# EAGLE design pm-001 (EAGLE 9.1.0)
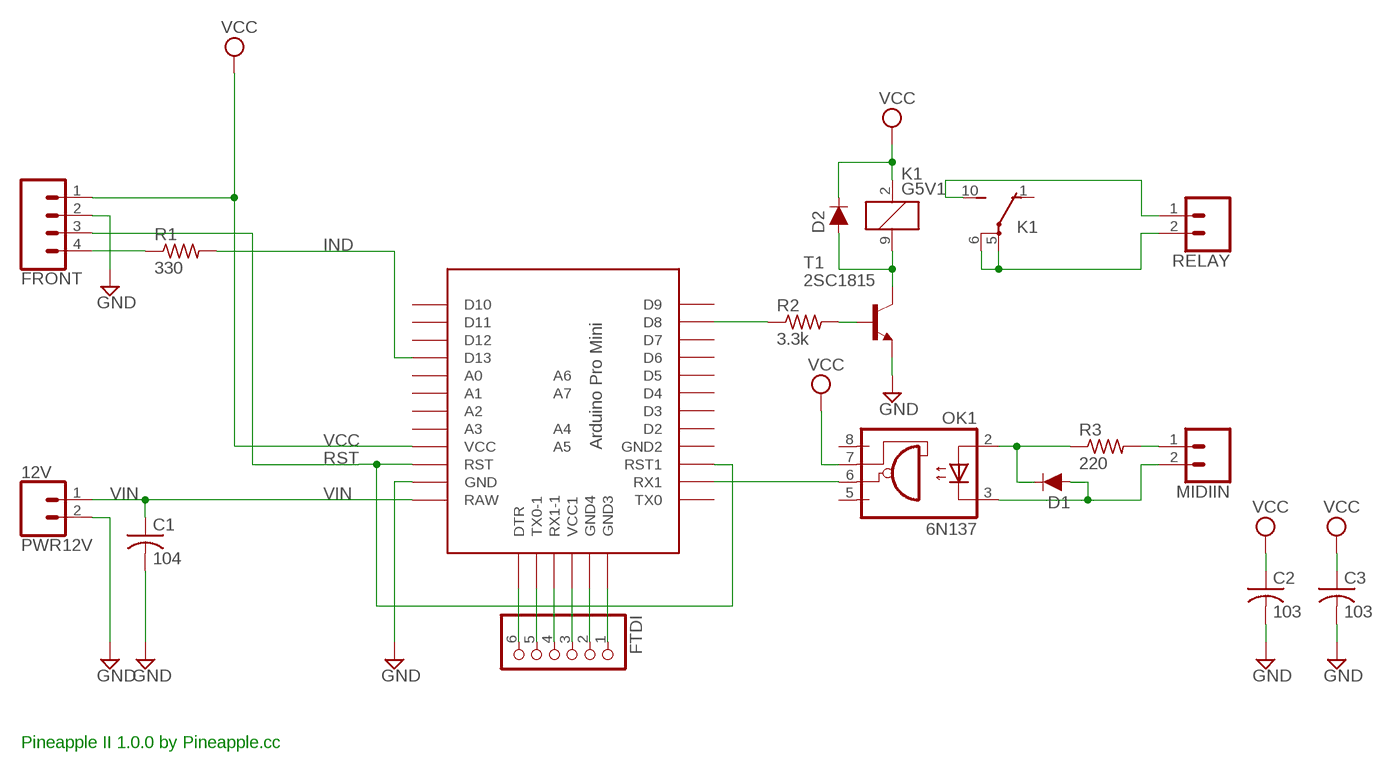
[diagram p0: schematic, sheet 1]

## Parts
C1  104  C-US025-025X050  [C025-025X050]
C2  103  C-US025-025X050  [C025-025X050]
C3  103  C-US025-025X050  [C025-025X050]
D1  DIODE-1N4148  [DIODE-1N4148]
D2  DIODE-1N4148  [DIODE-1N4148]
FRONT  CONN_04JST-PTH  [JST-4-PTH]
FTDI  PINHD-1X6  [1X06]
K1  G5V1  [G5V1]
MIDIIN  CONN_02JST-PTH-2  [JST-2-PTH]
OK1  6N137  [DIL08]
PWR12V  12V  CONN_02JST-PTH-2  [JST-2-PTH]
R1  330  R-US_0204/5  [0204/5]
R2  3.3k  R-US_0204/5  [0204/5]
R3  220  R-US_0204/5  [0204/5]
RELAY  CONN_02JST-PTH-2  [JST-2-PTH]
T1  2SC1815  [TO92-ECB]
U$1  PRO-MINI-2  [PRO-MINI-2]

## Nets
GND: C1.2 C2.2 C3.2 FRONT.2 PWR12V.2 T1.E U$1.GND
IND: R1.2 U$1.D13
N$1: FRONT.4 R1.1
N$2: MIDIIN.1 R3.2
N$3: OK1.6(VO) U$1.RX1
N$4: D1.C OK1.2(A) R3.1
N$5: D1.A MIDIIN.2 OK1.3(C)
N$6: R2.2 T1.B
N$7: R2.1 U$1.D8
N$8: D2.A K1.9 T1.C
N$9: FTDI.1 U$1.GND2(GND3)
N$10: K1.5(2:P) K1.6(2:P) RELAY.2
N$11: K1.10(2:S) RELAY.1
N$12: FTDI.2 U$1.GND3(GND4)
N$13: FTDI.3 U$1.VCC1
N$14: FTDI.4 U$1.RX1-1
N$15: FTDI.5 U$1.TX0-1
N$16: FTDI.6 U$1.DTR
RST: FRONT.3 U$1.RST U$1.RST1
VCC: C2.1 C3.1 D2.C FRONT.1 K1.2 OK1.7(VE) U$1.VCC
VIN: C1.1 PWR12V.1 U$1.RAW
Unconnected: K1.1(2:O) OK1.5(GND) OK1.8(VCC) U$1.A0 U$1.A1 U$1.A2 U$1.A3 U$1.A4 U$1.A5 U$1.A6 U$1.A7 U$1.D2 U$1.D3 U$1.D4 U$1.D5 U$1.D6 U$1.D7 U$1.D9 U$1.D10 U$1.D11 U$1.D12 U$1.GND1(GND2) U$1.TX0

## Notes on the sheet
- Pineapple II 1.0.0 by Pineapple.cc

## Library data of the parts
C1-C3 = rcl:C-US: CAPACITOR, American symbol
D1 D2 = SparkFun-DiscreteSemi:DIODE: Diode These are standard reverse protection diodes and small signal diodes. SparkFun Products: SparkFun SparkPunk Sound Kit <https://www.sparkfun.com/products/11177> SparkFun ESP8266 Thing <https://www.sparkfun.com/products/13231>; PROD_ID: DIO-08378; VALUE: 200mA/100V/1V
FRONT = SparkFun-Connectors:CONN_04: Multi connection point. Often used as Generic Header-pin footprint for 0.1 inch spaced/style header connections On any of the 0.1 inch spaced packages, you can populate with these: Break Away Headers - Straight <https://www.sparkfun.com/products/116> (PRT-00116) Break Away Male Headers - Right Angle <https://www.sparkfun.com/products/553> (PRT-00553) Female Headers <https://www.sparkfun.com/products/115> (PRT-00115) Break Away Headers - Machine Pin <https://www.sparkfun.com/products/117> (PRT-00117) Break Away Female Headers - Swiss Machine Pin <https://www.sparkfun.com/products/743> (PRT-00743) For SCREWTERMINALS and SPRING TERMINALS visit here: Screw Terimnals on SparkFun.com <https://www.sparkfun.com/search/results?term=Screw+Terminals> (5mm/3.5mm/2.54mm spacing) This device is also useful as a general connection point to wire up your design to another part of your project. Our various solder wires solder well into these plated through hole pads. Hook-Up Wire - Assortment (Stranded, 22 AWG) <https://www.sparkfun.com/products/11375> (PRT-11375) Hook-Up Wire - Assortment (Solid Core, 22 AWG) <https://www.sparkfun.com/products/11367> (PRT-11367) View the entire wire category on our website here <https://www.sparkfun.com/categories/141> Special notes: Molex polarized connector foot print use with SKU : PRT-08231 with associated crimp pins and housings. 1MM SMD Version SKU: PRT-10208; PROD_ID: WIRE-13531; SF_ID: PRT-09916
FTDI = pinhead:PINHD-1X6: PIN HEADER
K1 = relay:G5V1: RELAY 1 x switch, 0.5 A/125 V AC, 1 A/24 V DC , Omron; MPN: G5V-1-DC24; OC_FARNELL: 9949593; OC_NEWARK: 36M6377
MIDIIN PWR12V RELAY = SparkFun-Connectors:CONN_02: Multi connection point. Often used as Generic Header-pin footprint for 0.1 inch spaced/style header connections On any of the 0.1 inch spaced packages, you can populate with these: Break Away Headers - Straight <https://www.sparkfun.com/products/116> (PRT-00116) Break Away Male Headers - Right Angle <https://www.sparkfun.com/products/553> (PRT-00553) Female Headers <https://www.sparkfun.com/products/115> (PRT-00115) Break Away Headers - Machine Pin <https://www.sparkfun.com/products/117> (PRT-00117) Break Away Female Headers - Swiss Machine Pin <https://www.sparkfun.com/products/743> (PRT-00743) For SCREWTERMINALS and SPRING TERMINALS visit here: Screw Terimnals on SparkFun.com <https://www.sparkfun.com/search/results?term=Screw+Terminals> (5mm/3.5mm/2.54mm spacing) This device is also useful as a general connection point to wire up your design to another part of your project. Our various solder wires solder well into these plated through hole pads. Hook-Up Wire - Assortment (Stranded, 22 AWG) <https://www.sparkfun.com/products/11375> (PRT-11375) Hook-Up Wire - Assortment (Solid Core, 22 AWG) <https://www.sparkfun.com/products/11367> (PRT-11367) View the entire wire category on our website here <https://www.sparkfun.com/categories/141> Special notes: Molex polarized connector foot print use with: PRT-08233 with associated crimp pins and housings. 2.54_SCREWTERM for use with PRT-10571. 3.5mm Screw Terminal footprints for PRT-08084 5mm Screw Terminal footprints for use with PRT-08432; PROD_ID: CONN-09863; SKU: PRT-09914
OK1 = optocoupler:6N137: MOTOROLA OPTO COUPLER; MPN: 6N137; OC_FARNELL: 1328376; OC_NEWARK: 52M1895
R1-R3 = rcl:R-US_: RESISTOR, American symbol; SPICEPREFIX: R
T1 = transistor:2SC1815: NPN EPITAXIAL TRANSISTOR Source: TOSHIBA .. 2SC1815 1.pdf
U$1 = Arduino-clone:PRO-MINI-2: Arduino Pro Mini Layout 2 Sparkfun.com

## Net classes
0 default: width 0.254 mm, drill 0.254 mm, clearance 0.254 mm

## Board
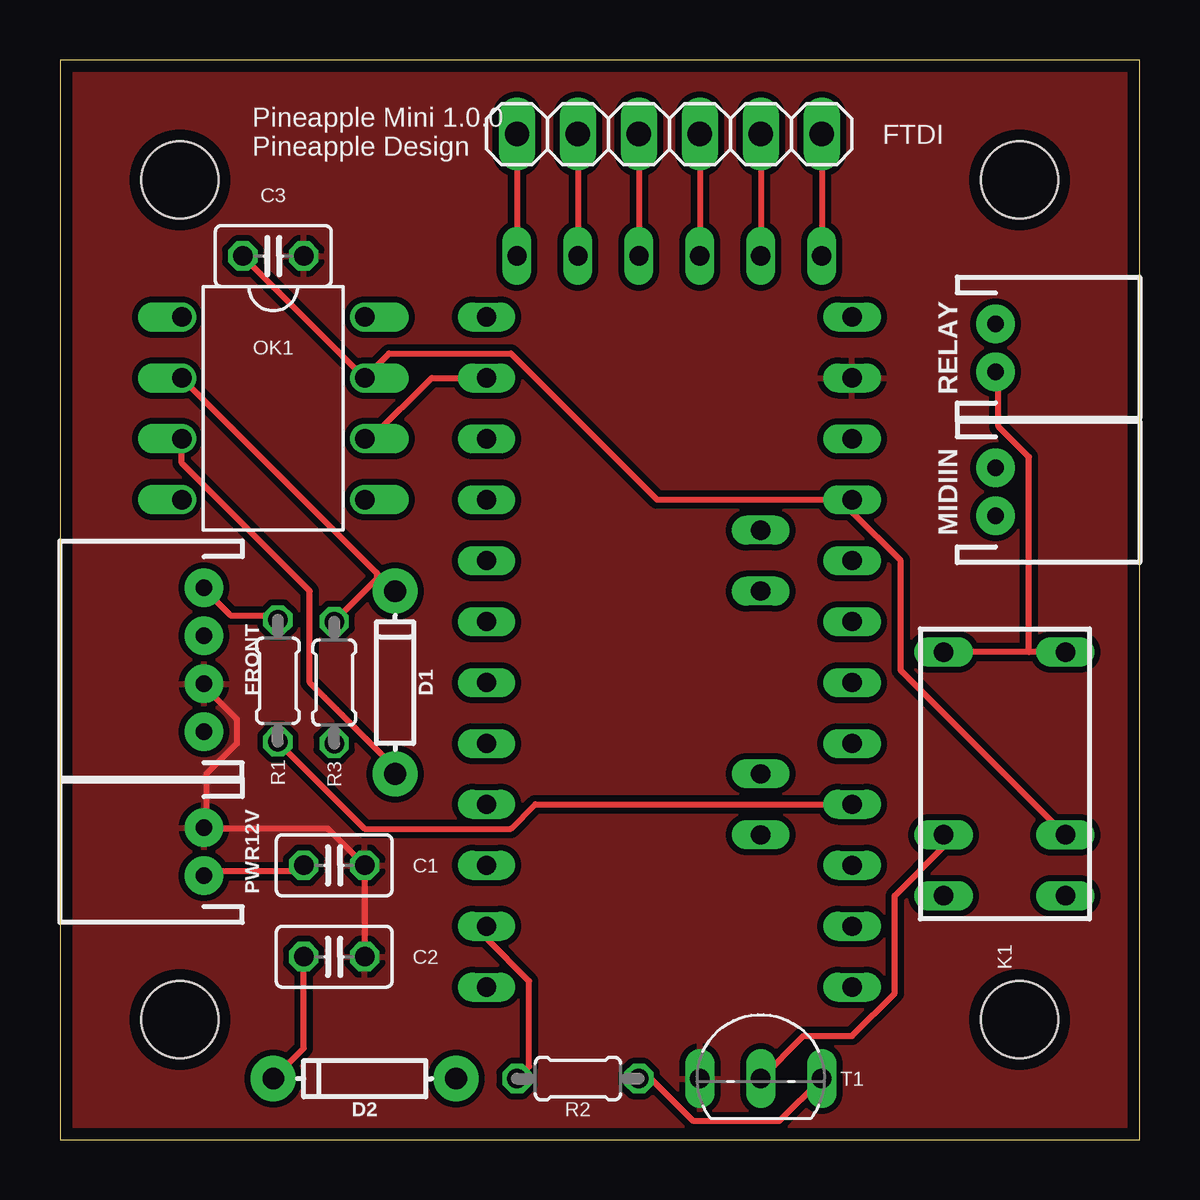
[diagram p1: board, top side]
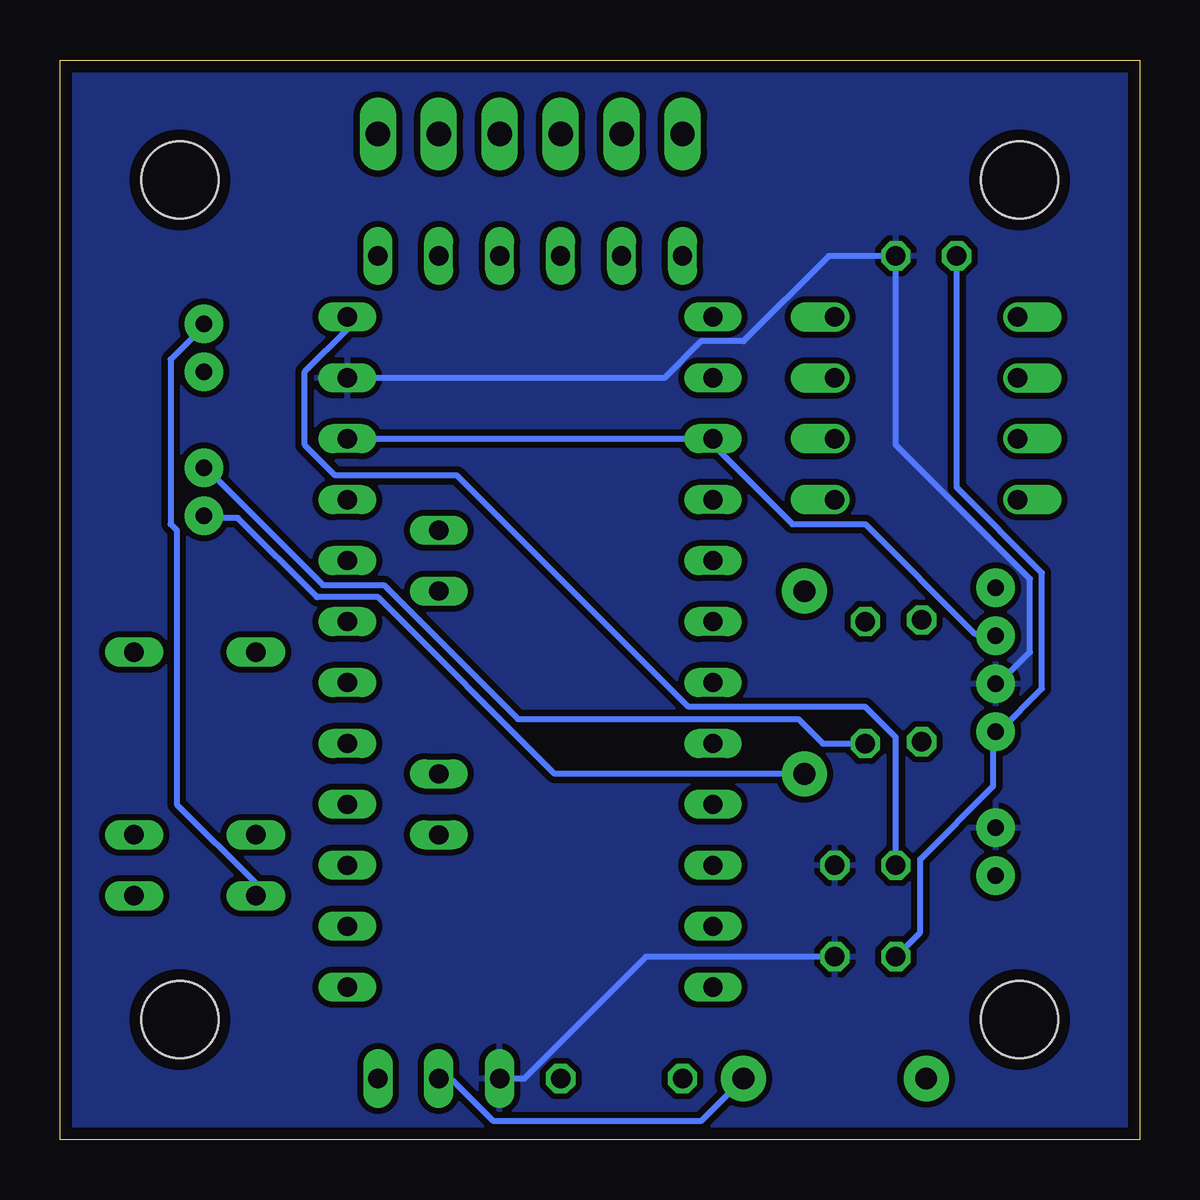
[diagram p2: board, bottom side, seen from below]

Size 45 x 45 mm. Coordinates in mm from the lower left corner, seen from the top.
Outline: 0,0 45,0 45,45 0,45 0,0
Copper layers (1*16): Top 0.035mm / dielectric 1.53mm / Bottom 0.035mm
Design rules "pban_5mil-l2": minimum track width 5mil, minimum drill 0.3mm, track to track 5mil, track to pad 0.229mm, pad to pad 5mil, via to via 5mil, smd to smd 5mil, copper to edge 0.5mm, drill to drill 0.5mm, minimum pad ring 0.15mm, minimum via ring 0.15mm, stop-mask expansion 4mil, vias tented up to drill 0.35mm, thermal gap 10mil
Holes 3.2 mm at 5,5 40,5 40,40 5,40

### Footprints (pad centres in the part's own frame; a part is rotated, then mirrored left to right if it is on the bottom)
C025-025X050 = drill 0.813 octagon: 1 -1.27,0; 2 1.27,0
DIODE-1N4148 = drill 0.9 pad 1.88: A -3.81,0; C 3.81,0
JST-4-PTH = drill 0.7 pad 1.6: 1 -3,0; 2 -1,0; 3 1,0; 4 3,0
1X06 = drill 1.016 long: 1 -6.35,0; 2 -3.81,0; 3 -1.27,0; 4 1.27,0; 5 3.81,0; 6 6.35,0
G5V1 = drill 0.813 long: 1 -5.08,-2.54; 2 -2.54,-2.54; 5 5.08,-2.54; 6 5.08,2.54; 9 -2.54,2.54; 10 -5.08,2.54
JST-2-PTH = drill 0.7 pad 1.6: 1 -1,0; 2 1,0
DIL08 = drill 0.813 offset: 1 -3.81,-3.81; 2 -1.27,-3.81; 3 1.27,-3.81; 4 3.81,-3.81; 5 3.81,3.81; 6 1.27,3.81; 7 -1.27,3.81; 8 -3.81,3.81
0204/5 = drill 0.813 octagon: 1 -2.54,0; 2 2.54,0
TO92-ECB = drill 0.813 long: B 2.54,0; C 0,0; E -2.54,0
PRO-MINI-2 = drill 0.8 long: A0 6.35,2.54; A1 6.35,0; A2 6.35,-2.54; A3 6.35,-5.08; A4 2.54,1.27; A5 2.54,3.81; A6 2.54,-8.89; A7 2.54,-6.35; D2 -8.89,2.54; D3 -8.89,0; D4 -8.89,-2.54; D5 -8.89,-5.08; D6 -8.89,-7.62; D7 -8.89,-10.16; D8 -8.89,-12.7; D9 -8.89,-15.24; D10 6.35,-15.24; D11 6.35,-12.7; D12 6.35,-10.16; D13 6.35,-7.62; DTR 5.08,15.24; GND 6.35,10.16; GND1 -8.89,5.08; GND2 -7.62,15.24; GND3 -5.08,15.24; RAW 6.35,12.7; RST 6.35,7.62; RST1 -8.89,7.62; RX1 -8.89,10.16; RX1-1 0,15.24; TX0 -8.89,12.7; TX0-1 2.54,15.24; VCC 6.35,5.08; VCC1 -2.54,15.24

### Placement (x,y rotation side)
C1  11.43,11.43 0 top
C2  11.43,7.62 0 top
C3  8.89,36.83 0 top
D1  13.97,19.05 90 top
D2  12.7,2.54 180 top
FRONT  6,20 90 top
FTDI  25.4,41.91 0 top
K1  39.37,15.24 90 top
MIDIIN  39,27 270 top
OK1  8.89,30.48 270 top
PWR12V  6,12 90 top
R1  9.08,19.12 270 top
R2  21.59,2.54 0 top
R3  11.43,19.05 270 top
RELAY  39,33 270 top
T1  29.21,2.54 0 top
U$1  26.67,21.59 0 top

### Tracks (layer width: path | path; a pad name or v marks a point on that pad's centre or on a via)
GND
  Top 0.254: FRONT.2 6.1,18.8 7.37,17.53 7.37,16.51 6.1,15.24 6.1,13.21 PWR12V.2 6.1,12.95 11.18,12.95 C1.2 C2.2
  Bottom 0.254: U$1.GND 19.81,31.75 18.29,33.27 16.51,33.27 12.95,36.83 C3.2 10.16,28.96 4.57,23.37 4.57,20.32 5.84,19.05 FRONT.2 | T1.E 25.65,2.54 20.57,7.62 C2.2
  pour Bottom: 0,0 45,0 45,45 0,45
  pour Top: 0,0 45,0 45,45 0,45
IND
  Top 0.254: U$1.D13 19.81,13.97 18.8,12.95 12.7,12.95 9.14,16.51 R1.2
N$1
  Top 0.254: R1.1 8.89,21.84 7.11,21.84 6.1,22.86 FRONT.4
N$2
  Bottom 0.254: R3.2 13.21,16.51 14.22,17.53 25.91,17.53 31.5,23.11 34.04,23.11 38.86,27.94 MIDIIN.1
N$3
  Top 0.254: U$1.RX1 15.49,31.75 12.95,29.21 OK1.6
N$4
  Top 0.254: D1.C 13.21,23.62 | 13.21,23.62 OK1.2 | R3.1 13.21,23.37 13.21,23.62
N$5
  Top 0.254: OK1.3 5.08,28.19 10.41,22.86 10.41,19.05 13.97,15.49 D1.A
  Bottom 0.254: D1.A 24.38,15.24 31.75,22.61 34.29,22.61 37.59,25.91 38.86,25.91 MIDIIN.2
N$6
  Top 0.254: R2.2 24.64,2.54 26.42,0.76 29.97,0.76 T1.B
N$7
  Top 0.254: U$1.D8 17.78,8.38 19.56,6.6 19.56,3.05 R2.1
N$8
  Top 0.254: K1.9 36.83,12.19 34.8,10.16 34.8,6.1 33.02,4.32 30.99,4.32 T1.C
  Bottom 0.254: T1.C 28.7,2.54 26.92,0.76 18.29,0.76 D2.A
N$9
  Top 0.254: FTDI.1 U$1.GND2
N$10
  Top 0.254: K1.5 40.39,20.32 | 40.39,20.32 K1.6 | 40.39,20.32 40.39,28.45 39.12,29.72 39.12,31.75 RELAY.2
N$11
  Bottom 0.254: K1.10 36.83,10.67 40.13,13.97 40.13,25.4 40.39,25.65 40.39,32.51 39.12,33.78 RELAY.1
N$12
  Top 0.254: FTDI.2 U$1.GND3
N$13
  Top 0.254: FTDI.3 U$1.VCC1
N$14
  Top 0.254: FTDI.4 U$1.RX1-1
N$15
  Top 0.254: FTDI.5 U$1.TX0-1
N$16
  Top 0.254: FTDI.6 U$1.DTR
RST
  Bottom 0.254: U$1.RST 18.03,29.21 | 18.03,29.21 U$1.RST1 18.03,29.21 | 18.03,29.21 14.48,25.65 11.43,25.65 6.86,21.08 6.1,21.08 FRONT.3
VCC
  Top 0.254: K1.2 35.05,19.56 35.05,24.13 33.02,26.16 U$1.VCC 24.89,26.67 18.8,32.77 13.72,32.77 OK1.7 C3.1 | C2.1 10.16,3.81 D2.C
  Bottom 0.254: C2.1 9.14,8.64 9.14,11.68 6.1,14.73 6.1,16.76 FRONT.1 5.84,17.02 4.06,18.8 4.06,23.62 7.62,27.18 C3.1
VIN
  Top 0.254: C1.1 9.91,11.18 6.1,11.18 PWR12V.1
  Bottom 0.254: U$1.RAW 33.02,33.78 34.8,32 34.8,28.96 33.53,27.69 28.45,27.69 18.8,18.03 11.43,18.03 10.16,16.76 C1.1

### Text on the board
tNames: Pineapple Mini 1.0.0 / Pineapple Design